# EAGLE board moire_v2.1 (EAGLE 9.2.0)
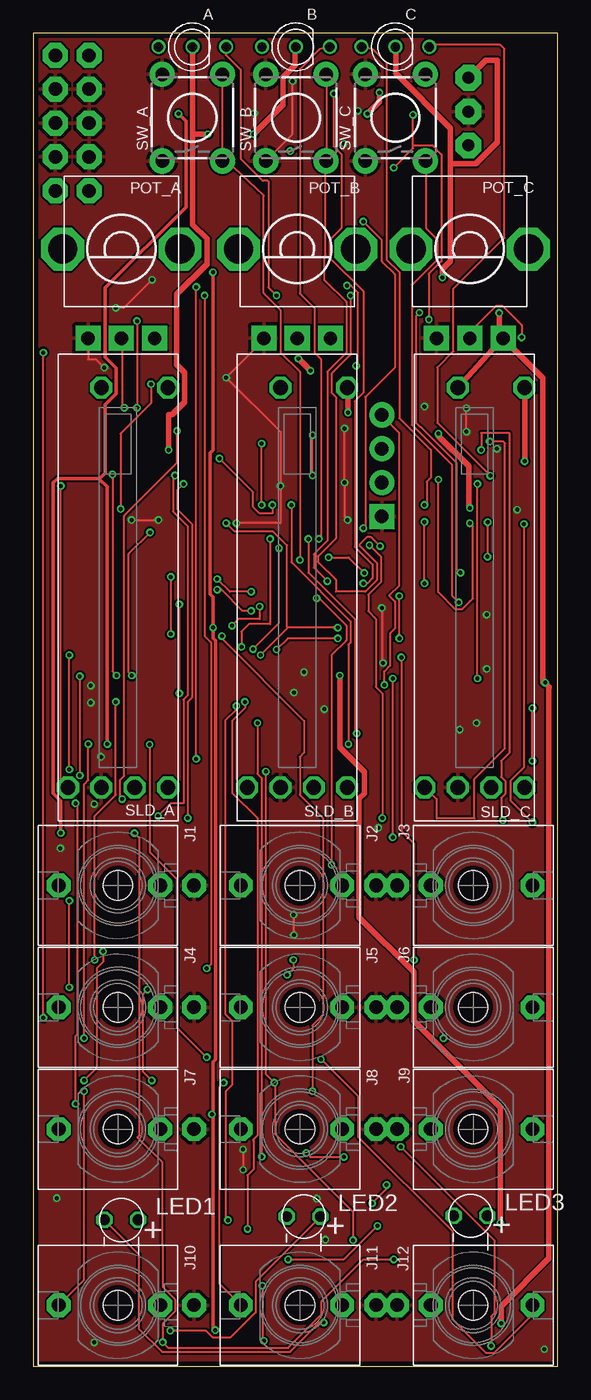
[diagram p3: board, top side]
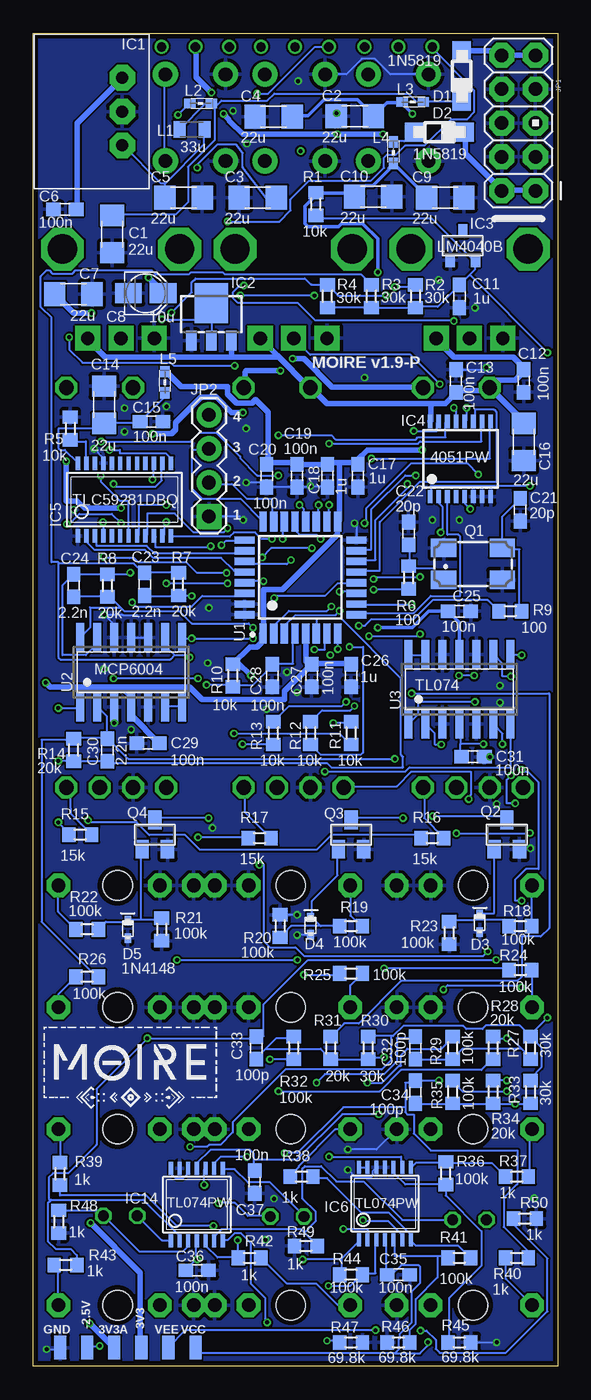
[diagram p4: board, bottom side, seen from below]

Size 39.35 x 100 mm. Coordinates in mm from the lower left corner, seen from the top.
Outline: 0,0 39.35,0 39.35,100 0,100 0,0
Copper layers (1*16): Top 0.035559375mm / dielectric 1.6mm / Bottom 0.035559375mm
Design rules "oshpark-2layer *": minimum track width 6mil, minimum drill 0.3mm, track to track 6mil, track to pad 6mil, pad to pad 6mil, via to via 6mil, smd to smd 0mil, copper to edge 15mil, drill to drill 6mil, minimum pad ring 5mil, minimum via ring 5mil, stop-mask expansion 2.5mil, vias tented up to drill 13mil, thermal gap 10mil
Net classes: 1 power: width 0.406 mm

## Footprints (pad centres in the part's own frame; a part is rotated, then mirrored left to right if it is on the bottom)
LED-BICOLOR-THROUGHHOLE-LUMEX = drill 0.7: A 0,0; GREEN_C 2.54,0; RED_C -2.54,0
RCL_C1206 = smd 1.6 x 1.8: 1 -1.4,0; 2 1.4,0
RCL_C0603 = smd 1.1 x 1: 1 -0.85,0; 2 0.85,0
RCL_PANASONIC_A = smd 2 x 1.5: + 1.3,0; - -1.3,0
DIODE_SOD123 = smd 1.4 x 1.4: A 1.9,0; C -1.9,0
DIODE_SOD523 = smd 0.7 x 0.5: A 0.7,0; C -0.6,0
WE78 = drill 0.9 pad 1.93 octagon: 1 -2.54,0; 2 0,0; 3 2.54,0
SOT89 = smd 0.8 x 1.5: 1 -1.5,-1.75; 2 0,-1.75; 3 1.5,-1.75 | smd 2.5 x 3: 4 0,1.05
DBZ_R-PDSO-G3 = smd 0.7 x 1: 1 -0.95,-1.1; 2 0.95,-1.1; 3 0,1.1
TSSOP16_065 = smd 0.35 x 1: 1 -1.95,-2.825; 2 -1.3,-2.825; 3 -0.65,-2.825; 4 0,-2.825; 5 0.65,-2.825; 6 1.3,-2.825; 7 1.95,-2.825; 8 2.6,-2.825; 9 2.6,2.825; 10 1.95,2.825; 11 1.3,2.825; 12 0.65,2.825; 13 0,2.825; 14 -0.65,2.825; 15 -1.3,2.825; 16 -1.95,2.825
TSSOP24_0635 = smd 0.33 x 1: 1 -3.493,-2.725; 2 -2.857,-2.725; 3 -2.223,-2.725; 4 -1.587,-2.725; 5 -0.953,-2.725; 6 -0.318,-2.725; 7 0.318,-2.725; 8 0.953,-2.725; 9 1.587,-2.725; 10 2.223,-2.725; 11 2.857,-2.725; 12 3.493,-2.725; 13 3.493,2.725; 14 2.857,2.725; 15 2.223,2.725; 16 1.587,2.725; 17 0.953,2.725; 18 0.318,2.725; 19 -0.318,2.725; 20 -0.953,2.725; 21 -1.587,2.725; 22 -2.223,2.725; 23 -2.857,2.725; 24 -3.493,2.725
TSSOP14_065 = smd 0.305 x 0.991: 1 -1.95,-2.718; 2 -1.3,-2.718; 3 -0.65,-2.718; 4 0,-2.718; 5 0.65,-2.718; 6 1.3,-2.718; 7 1.95,-2.718; 8 1.95,2.718; 9 1.3,2.718; 10 0.65,2.718; 11 0,2.718; 12 -0.65,2.718; 13 -1.3,2.718; 14 -1.95,2.718
WQP_PJ_301M6 = drill 1.016 pad 1.778 octagon: P1 0,-5.715; P2 0,-3.175; P3 0,4.445 | hole 2.2: 0,0
2X5-PTH = drill 1.016 pad 1.88 octagon: 1 -1.27,5.08; 2 1.27,5.08; 3 -1.27,2.54; 4 1.27,2.54; 5 -1.27,0; 6 1.27,0; 7 -1.27,-2.54; 8 1.27,-2.54; 9 -1.27,-5.08; 10 1.27,-5.08
1X04 = drill 1.016 pad 1.88 square: 1 0,0 | drill 1.016 pad 1.88: 2 2.54,0; 3 5.08,0; 4 7.62,0
L2012C = smd 0.9 x 1.25: 1 -0.9,0; 2 1,0
0603 = smd 0.85 x 0.7: 1 -0.9,0; 2 0.7,0
LED3MM = drill 0.813 octagon: 1 -1.27,0; 2 1.27,0
ALPS_POT_VERTICAL = drill 1 pad 1.88 square: P$1 -2.5,6.7; P$2 0,6.7; P$3 2.5,6.7 | drill 2.2 pad 3.175 octagon: P$4 -4.4,0; P$5 4.4,0
CTS406 = smd 1.9 x 1.4: 1 -2.2,-1.2; 2 2.2,-1.2; 3 2.2,1.2; 4 -2.2,1.2
SOT23-BEC = smd 1 x 1.4: B -0.95,-1.1; C 0,1.1; E 0.95,-1.1
RCL_R0603 = smd 1 x 1.1: 1 -0.85,0; 2 0.85,0
BOURNS_SLIDER = drill 1.1 octagon: 1 -15,1.25; 2 -15,3.75; 3 15,1.25; B 15,-3.75; DUMMY -15,-1.25; E -15,-3.75
TACTILE-PTH = drill 1.016 pad 1.88: 1 -3.251,2.261; 2 3.251,2.261; 3 -3.251,-2.261; 4 3.251,-2.261
QFP80P900X900X160-32N = smd 1.5 x 0.55: 1 -4.2,2.8; 2 -4.2,2; 3 -4.2,1.2; 4 -4.2,0.4; 5 -4.2,-0.4; 6 -4.2,-1.2; 7 -4.2,-2; 8 -4.2,-2.8; 17 4.2,-2.8; 18 4.2,-2; 19 4.2,-1.2; 20 4.2,-0.4; 21 4.2,0.4; 22 4.2,1.2; 23 4.2,2; 24 4.2,2.8 | smd 0.55 x 1.5: 9 -2.8,-4.2; 10 -2,-4.2; 11 -1.2,-4.2; 12 -0.4,-4.2; 13 0.4,-4.2; 14 1.2,-4.2; 15 2,-4.2; 16 2.8,-4.2; 25 2.8,4.2; 26 2,4.2; 27 1.2,4.2; 28 0.4,4.2; 29 -0.4,4.2; 30 -1.2,4.2; 31 -2,4.2; 32 -2.8,4.2
SO14 = smd 0.6 x 2.2: 1 -3.81,-2.6; 2 -2.54,-2.6; 3 -1.27,-2.6; 4 0,-2.6; 5 1.27,-2.6; 6 2.54,-2.6; 7 3.81,-2.6; 8 3.81,2.6; 9 2.54,2.6; 10 1.27,2.6; 11 0,2.6; 12 -1.27,2.6; 13 -2.54,2.6; 14 -3.81,2.6
6X1-SMD-TESTPAD = smd 0.914 x 1.778: 1 0,0.123; 2 -2.032,0.123; 3 -4.064,0.123; 4 -6.096,0.123; 5 -8.128,0.123; 6 -10.16,0.123

## Placement (x,y rotation side)
A  SSL-LX3059IGW-CA  [LED-BICOLOR-THROUGHHOLE-LUMEX]  11.94,98.98 180 top
B  SSL-LX3059IGW-CA  [LED-BICOLOR-THROUGHHOLE-LUMEX]  19.71,98.98 180 top
C  SSL-LX3059IGW-CA  [LED-BICOLOR-THROUGHHOLE-LUMEX]  27.18,98.98 180 top
C1  22u  [RCL_C1206]  33.43,84.94 270 bottom
C2  22u  [RCL_C1206]  15.21,93.78 180 bottom
C3  22u  [RCL_C1206]  22.5,87.68 180 bottom
C4  22u  [RCL_C1206]  21.31,93.75 180 bottom
C5  22u  [RCL_C1206]  28.07,87.68 0 bottom
C6  100n  [RCL_C0603]  36.98,86.79 180 bottom
C7  22u  [RCL_C1206]  36.35,80.44 0 bottom
C8  10u  [RCL_PANASONIC_A]  30.91,80.49 0 bottom
C9  22u  [RCL_C1206]  8.43,87.68 180 bottom
C10  22u  [RCL_C1206]  13.84,87.73 180 bottom
C11  1u  [RCL_C0603]  7.37,80.26 270 bottom
C12  100n  [RCL_C0603]  2.54,73.91 270 bottom
C13  100n  [RCL_C0603]  7.62,73.91 90 bottom
C14  22u  [RCL_C1206]  34.04,72.14 90 bottom
C15  100n  [RCL_C0603]  30.48,70.87 0 bottom
C16  22u  [RCL_C1206]  2.54,69.34 270 bottom
C17  1u  [RCL_C0603]  14.99,66.8 270 bottom
C18  1u  [RCL_C0603]  17.27,66.8 270 bottom
C19  100n  [RCL_C0603]  19.56,66.8 270 bottom
C20  100n  [RCL_C0603]  21.84,66.8 270 bottom
C21  20p  [RCL_C0603]  2.79,64.26 90 bottom
C22  20p  [RCL_C0603]  11.18,62.48 270 bottom
C23  2.2n  [RCL_C0603]  30.99,58.67 270 bottom
C24  2.2n  [RCL_C0603]  36.32,58.57 270 bottom
C25  100n  [RCL_C0603]  7.37,56.64 180 bottom
C26  1u  [RCL_C0603]  15.49,51.82 270 bottom
C27  100n  [RCL_C0603]  18.46,51.82 270 bottom
C28  100n  [RCL_C0603]  21.42,51.82 270 bottom
C29  100n  [RCL_C0603]  30.73,46.74 180 bottom
C30  2.2n  [RCL_C0603]  33.78,46.23 270 bottom
C31  100n  [RCL_C0603]  6.35,45.72 0 bottom
C32  100p  [RCL_C0603]  10.67,23.88 90 bottom
C33  100p  [RCL_C0603]  22.61,23.88 90 bottom
C34  100p  [RCL_C0603]  10.67,20.57 90 bottom
C35  100n  [RCL_C0603]  11.94,6.86 0 bottom
C36  100n  [RCL_C0603]  27.05,7.19 0 bottom
C37  100n  [RCL_C0603]  22.73,13.82 90 bottom
D1  1N5819  [DIODE_SOD123]  7.19,96.8 90 bottom
D2  1N5819  [DIODE_SOD123]  8.86,92.58 180 bottom
D3  1N4148  [DIODE_SOD523]  5.84,33.27 270 bottom
D4  1N4148  [DIODE_SOD523]  18.54,33.07 270 bottom
D5  1N4148  [DIODE_SOD523]  32.26,32.83 270 bottom
IC1  R-78E3.3-0.5  [WE78]  32.66,94.13 90 bottom
IC2  AP7380  [SOT89]  25.98,78.69 0 bottom
IC3  LM4040B  [DBZ_R-PDSO-G3]  7.11,84.07 0 bottom
IC4  4051PW  [TSSOP16_065]  7.62,68.07 0 bottom
IC5  TLC59281DBQ  [TSSOP24_0635]  32.51,65.02 0 bottom
IC6  TL074PW  [TSSOP14_065]  12.95,12.19 0 bottom
IC14  TL074PW  [TSSOP14_065]  27.08,12.12 0 bottom
J1  PJ301_THONKICONN6  [WQP_PJ_301M6]  6.35,36.07 90 top
J2  PJ301_THONKICONN6  [WQP_PJ_301M6]  20.02,36.07 90 top
J3  PJ301_THONKICONN6  [WQP_PJ_301M6]  33.02,36.07 270 top
J4  PJ301_THONKICONN6  [WQP_PJ_301M6]  6.35,26.92 90 top
J5  PJ301_THONKICONN6  [WQP_PJ_301M6]  20.02,26.92 90 top
J6  PJ301_THONKICONN6  [WQP_PJ_301M6]  33.02,26.92 270 top
J7  PJ301_THONKICONN6  [WQP_PJ_301M6]  6.35,17.78 90 top
J8  PJ301_THONKICONN6  [WQP_PJ_301M6]  20.02,17.78 90 top
J9  PJ301_THONKICONN6  [WQP_PJ_301M6]  33.02,17.78 270 top
J10  PJ301_THONKICONN6  [WQP_PJ_301M6]  6.35,4.57 90 top
J11  PJ301_THONKICONN6  [WQP_PJ_301M6]  20.02,4.57 90 top
J12  PJ301_THONKICONN6  [WQP_PJ_301M6]  33.02,4.57 270 top
JP1  M05X2PTH  [2X5-PTH]  2.92,93.27 180 bottom
JP2  [1X04]  26.16,63.75 90 bottom
L1  33u  [L2012C]  27.48,92.79 0 bottom
L2  [0603]  26.7,94.74 0 bottom
L3  [0603]  10.77,94.84 0 bottom
L4  [0603]  12.31,91.14 90 bottom
L5  [0603]  29.46,73.91 90 bottom
LED1  WP937EGW  [LED3MM]  6.6,10.97 0 top
LED2  WP937EGW  [LED3MM]  20.29,11.23 0 top
LED3  WP937EGW  [LED3MM]  32.82,11.28 0 top
POT_A  10kB  [ALPS_POT_VERTICAL]  6.6,83.82 180 top
POT_B  10kB  [ALPS_POT_VERTICAL]  19.81,83.82 180 top
POT_C  10kB  [ALPS_POT_VERTICAL]  32.77,83.82 180 top
Q1  8MHz  [CTS406]  6.35,60.2 0 bottom
Q2  MMBT3904  [SOT23-BEC]  3.81,39.88 0 bottom
Q3  MMBT3904  [SOT23-BEC]  15.49,39.88 0 bottom
Q4  MMBT3904  [SOT23-BEC]  30.23,39.88 0 bottom
R1  10k  [RCL_R0603]  18.14,87.2 270 bottom
R2  30k  [RCL_R0603]  10.67,80.26 270 bottom
R3  30k  [RCL_R0603]  13.97,80.26 270 bottom
R4  30k  [RCL_R0603]  17.27,80.26 270 bottom
R5  10k  [RCL_R0603]  36.58,70.36 90 bottom
R6  100  [RCL_R0603]  11.18,59.18 90 bottom
R7  20k  [RCL_R0603]  28.45,58.67 90 bottom
R8  20k  [RCL_R0603]  33.78,58.57 90 bottom
R9  100  [RCL_R0603]  3.56,56.64 0 bottom
R10  10k  [RCL_R0603]  24.38,51.82 270 bottom
R11  10k  [RCL_R0603]  15.49,47.5 270 bottom
R12  10k  [RCL_R0603]  18.54,47.5 270 bottom
R13  10k  [RCL_R0603]  21.34,47.5 270 bottom
R14  20k  [RCL_R0603]  36.32,46.23 90 bottom
R15  15k  [RCL_R0603]  35.81,39.88 180 bottom
R16  15k  [RCL_R0603]  9.4,39.62 180 bottom
R17  15k  [RCL_R0603]  22.35,39.62 180 bottom
R18  100k  [RCL_R0603]  2.79,33.02 180 bottom
R19  100k  [RCL_R0603]  15.49,33.02 180 bottom
R20  100k  [RCL_R0603]  20.83,33.02 270 bottom
R21  100k  [RCL_R0603]  29.72,32.77 90 bottom
R22  100k  [RCL_R0603]  35.31,32.77 0 bottom
R23  100k  [RCL_R0603]  8.13,32.51 90 bottom
R24  100k  [RCL_R0603]  2.79,29.72 0 bottom
R25  100k  [RCL_R0603]  15.49,29.46 0 bottom
R26  100k  [RCL_R0603]  35.31,29.21 180 bottom
R27  30k  [RCL_R0603]  2.03,23.88 90 bottom
R28  20k  [RCL_R0603]  4.83,23.88 270 bottom
R29  100k  [RCL_R0603]  7.87,23.88 270 bottom
R30  30k  [RCL_R0603]  14.22,23.88 90 bottom
R31  20k  [RCL_R0603]  17.02,23.88 90 bottom
R32  100k  [RCL_R0603]  19.81,23.88 90 bottom
R33  30k  [RCL_R0603]  2.03,20.57 90 bottom
R34  20k  [RCL_R0603]  4.83,20.57 90 bottom
R35  100k  [RCL_R0603]  7.87,20.57 270 bottom
R36  100k  [RCL_R0603]  8.38,14.48 270 bottom
R37  1k  [RCL_R0603]  3.05,14.22 180 bottom
R38  1k  [RCL_R0603]  19.2,14.22 0 bottom
R39  1k  [RCL_R0603]  37.34,14.43 270 bottom
R40  1k  [RCL_R0603]  3.05,8.13 0 bottom
R41  100k  [RCL_R0603]  7.37,8.13 180 bottom
R42  1k  [RCL_R0603]  23.11,8.13 180 bottom
R43  1k  [RCL_R0603]  36.93,7.59 0 bottom
R44  100k  [RCL_R0603]  15.49,6.86 0 bottom
R45  69.8k  [RCL_R0603]  7.37,1.78 0 bottom
R46  69.8k  [RCL_R0603]  11.94,1.78 180 bottom
R47  69.8k  [RCL_R0603]  15.49,1.78 0 bottom
R48  1k  [RCL_R0603]  37.44,10.85 270 bottom
R49  1k  [RCL_R0603]  18.9,9.02 180 bottom
R50  1k  [RCL_R0603]  2.44,11.07 0 bottom
SLD_A  20kB  [BOURNS_SLIDER]  6.35,58.42 90 top
SLD_B  20kB  [BOURNS_SLIDER]  19.81,58.42 90 top
SLD_C  20kB  [BOURNS_SLIDER]  33.12,58.42 90 top
SW_A  [TACTILE-PTH]  11.94,93.68 90 top
SW_B  [TACTILE-PTH]  19.71,93.68 90 top
SW_C  [TACTILE-PTH]  27.18,93.68 90 top
U1  STM32F303K8T6  [QFP80P900X900X160-32N]  19.3,59.18 90 bottom
U2  MCP6004  [SO14]  32,52.07 0 bottom
U3  TL074  [SO14]  7.37,50.8 0 bottom
U$1  1X6-SMD-TESTPAD  [6X1-SMD-TESTPAD]  27.18,1.27 0 bottom

## Tracks (layer width: path | path; a pad name or v marks a point on that pad's centre or on a via)
+3V3  (via drill 0.3)
  Top 0.406: v10.16,68.74 10.16,71.4 10.41,71.4 11.35,72.34 11.35,74.55 10.77,75.13 10.77,80.42 13.03,82.68 13.03,84.58 11.96,85.65 11.96,92.43 | C.A 27.2,98.98 27.2,97 31.32,92.89 31.32,90.22 | 11.96,92.43 11.96,98.98 A.A | v16.54,92.43 18.75,94.64 18.75,96.7 19.66,97.61 19.66,98.98 B.A | 11.96,92.43 v13.11,92.43 | v30.71,81.69 30.71,82.3 31.32,82.91 31.32,90.22 | 31.32,90.22 33.22,90.22 34.82,91.82 34.82,97.99 33.98,97.99 IC1.3 | v25.98,95.56 25.98,94.87 v25.07,93.95 | v35.05,10.74 35.05,19.43 28.57,25.91 28.57,29.57 24.46,33.68 24.46,42.6 24.84,42.98 24.84,44.58 23.01,46.41 v23.01,51.82
  Bottom 0.406: L5.2 29.37,74.61 28.26,73.5 24.77,73.5 24.77,72.92 24.08,72.24 22.94,72.24 22.66,72.51 21.75,71.6 21.75,67.94 C20.1 21.75,67.79 19.68,67.79 C19.1 19.37,67.63 17.46,67.63 C18.1 17.14,67.79 16.35,67.79 | 16.35,67.79 15.08,67.79 C17.1 15.08,67.94 14.29,68.74 v10.16,68.74 | 16.35,67.79 16.35,63.5 U1.17 16.51,63.18 16.51,62.39 20.64,58.26 22.07,58.26 22.07,55.09 U1.1 22.23,54.93 22.23,54.29 22.54,53.98 23.07,53.98 R10.1 24,52.81 v23.01,51.82 | v13.11,92.43 v16.54,92.43 23.62,92.43 24.61,93.42 24.69,93.57 v25.07,93.95 | C8.+ 29.56,80.54 v30.71,81.69 | C6.1 36.04,86.86 36.04,93.27 32.69,96.62 IC1.3 | v25.98,95.56 27.13,96.7 27.13,98.98 C.A | v35.05,10.74 31.32,7.01 31.32,1.6 U$1.3
+3V3_A  (via drill 0.3)
  Top 0.406: SLD_C.3 POT_C.P$1 | POT_C.P$1 35.4,76.99 38.26,74.14 38.26,51.28 v38.42,51.28 38.73,50.96 38.71,50.83 38.71,8.08 35.12,4.48 v35.12,3.21 | v34.98,79.02 34.98,77.57 35.2,77.34 POT_C.P$1
  Bottom 0.406: 9.53,72.23 9.53,70.96 IC4.16 | 9.53,72.23 8.41,72.23 7.62,73.03 C13.1 7.46,73.18 5.08,73.18 SLD_A.3 | SLD_A.3 5.08,73.5 4.6,73.98 3.17,73.98 2.54,74.61 C12.1 2.54,74.93 3.33,75.72 7.78,75.72 9.05,76.99 POT_A.P$1 | 9.53,72.23 17.3,72.23 18.41,73.34 SLD_B.3 18.73,73.5 21.03,75.8 | 21.03,75.8 22.23,76.99 POT_B.P$1 | 24.49,75.72 21.11,75.72 21.03,75.8 | 24.49,75.72 33.97,75.72 35.24,76.99 POT_C.P$1 | C26.1 15.56,52.7 18.41,52.7 C27.1 | U1.5 18.89,54.93 18.89,52.86 18.41,52.86 C27.1 | C29.1 30,46.83 31.91,48.74 31.91,49.37 U2.4 32.07,49.53 32.07,50.32 32.7,50.96 | v35.12,3.21 33.34,1.43 U$1.4 | v38.42,51.28 38.1,50.96 32.7,50.96 | 32.7,50.96 27.62,50.96 26.67,50.01 20.48,50.01 20.48,50.64 18.57,52.55 C27.1 | SLD_A.3 2.54,70.86 C16.1 | 24.49,75.72 24.48,75.72 IC2.3 | v34.98,79.02 36.33,79.02 C7.1
+12V
  Bottom 0.406: D1.A 7.16,98.68 4.5,98.68 4.19,98.37 JP1.10 4.04,98.37 1.68,98.37 JP1.9
-12V
  Bottom 0.406: D2.C 6.93,92.58 6.93,90.98 4.19,88.24 JP1.2 4.04,88.24 1.68,88.24 JP1.1
A_ADC  (via drill 0.3)
  Top 0.152: v10.95,57.15 v10.95,50.48
  Bottom 0.152: v10.95,50.48 0.64,50.48 0.64,32.86 1.27,32.23 2.7,32.23 2.7,29.21 3.02,28.89 11.75,28.89 14.92,25.72 16.03,25.72 16.05,25.7 16.05,25.69 R31.2 | v10.95,57.15 15.08,57.15 U1.10
A_CV  (via drill 0.3)
  Top 0.152: v37.47,45.4 v37.47,49.37
  Bottom 0.152: U1.6 18.1,55.09 18.1,56.04 16.19,56.04 11.75,51.59 11.75,45.88 11.59,45.72 11.59,44.93 16.99,44.93 17.3,45.24 33.66,45.24 C30.2 33.81,45.4 36.2,45.4 R14.1 36.35,45.4 v37.47,45.4 | v37.47,49.37 35.88,49.37 U2.1
A_GATE  (via drill 0.3)
  Top 0.152: v23.65,46.67 23.65,54.13 23.81,54.29 23.81,55.88 19.37,60.33 v19.37,64.61
  Bottom 0.152: v19.37,64.61 19.05,64.29 19.05,63.5 U1.20 | v23.65,46.67 21.36,46.67 R13.2
A_TRIG  (via drill 0.3)
  Top 0.152: v26.19,41.12 26.19,50.48 25.72,50.96 25.72,56.07 25.15,56.64 25.15,57.89 26.1,58.85 26.1,60.73 v25.23,61.59
  Bottom 0.152: v26.19,41.12 30.16,41.12 Q4.C | v25.23,61.59 24.92,61.91 23.65,61.91 U1.25
A_TRIG_IN
  Bottom 0.152: R22.1 37.47,34.08 J3.P3
ADC_TIME_SHAPE
  Bottom 0.152: IC4.3 8.26,65.25 8.26,62.39 7.46,62.39 7.3,62.23 7.3,57.78 9.53,57.78 10.79,56.52 15.08,56.52 U1.9
AREF_-2.5  (via drill 0.3)
  Top 0.152: v34.37,1.52 34.37,3.73 34.59,3.96 34.59,9.45 v27.58,16.46 | v0.76,26.14 v0.76,76.05
  Bottom 0.152: R4.2 17.22,79.4 14.02,79.4 R3.2 13.95,79.4 R2.2 10.67,79.48 8.99,79.48 7.39,81.08 C11.1 7.32,81.15 6.59,81.88 | 6.59,81.88 6.17,82.3 6.17,82.91 IC3.2 6.25,82.91 9.42,86.08 18.14,86.08 R1.2 | R33.2 1.98,21.49 1.98,21.64 1.22,22.4 1.22,23.93 1.98,24.69 R27.2 | 12.5,24.77 12.34,24.77 11.58,25.53 7.09,25.53 6.86,25.3 5.64,25.3 5.38,25.55 2.85,25.55 2.06,24.77 R27.2 | 12.5,24.77 14.17,24.77 R30.2 | v34.37,1.52 34.44,1.45 35.28,1.45 U$1.5 | v27.58,16.46 26.29,16.46 26.14,16.61 25.3,16.61 24.38,17.53 24.38,18.29 20.42,22.25 13.18,22.25 12.5,22.94 12.5,24.77 | v0.76,76.05 6.55,81.84 6.59,81.88 | v0.76,26.14 2.06,24.84 R27.2
B_ADC  (via drill 0.3)
  Top 0.152: v20.95,20.64 20.95,25.56 21.75,26.35 21.75,41.12 20,42.86 20,45.72 20.32,46.04 20.32,48.42 14.15,54.59 v14.15,54.77 | v10.32,59.21 v10.32,54.93 | v13.81,59.05 14.76,58.1 v16.35,58.1
  Bottom 0.152: v20.95,20.64 13.34,20.64 11.75,22.23 5.71,22.23 4.91,23.03 R28.2 | v14.15,54.77 10.48,54.77 v10.32,54.93 | v10.32,59.21 13.65,59.21 v13.81,59.05 | v16.35,58.1 15.24,58.1 U1.11
B_CV  (via drill 0.3)
  Top 0.152: v18.26,53.77 19.1,54.61 v22.86,54.61 | v27.46,54.61 v27.46,57.78
  Bottom 0.152: v18.26,53.77 17.46,53.77 17.46,54.93 U1.7 | v22.86,54.61 v27.46,54.61 28.1,54.61 U2.8 | v27.46,57.78 28.42,57.78 R7.1 28.57,57.78 30.95,57.78 C23.2
B_CV_IN
  Bottom 0.152: R25.2 14.76,29.37 15.56,28.57 15.56,26.94 J5.P3
B_GATE  (via drill 0.3)
  Top 0.152: v17.78,62.07 17.78,55.68 16.18,55.68 15.62,55.12 v15.62,53.96
  Bottom 0.152: v15.62,53.96 14.61,53.96 14.61,46.04 14.76,45.88 17.78,45.88 17.78,45.89 R12.2 | v17.78,62.07 18.1,62.39 19.37,62.39 19.68,62.71 19.68,63.34 U1.21
B_TRIG  (via drill 0.3)
  Top 0.152: v11.59,41.12 11.59,49.85 11.91,50.16 11.91,63.18 10.79,64.29 10.79,65.72 v11.27,66.2
  Bottom 0.152: v11.59,41.12 15.4,41.12 Q3.C | v11.27,66.2 11.27,65.88 13.65,63.5 13.65,60.48 15.08,60.48 U1.14
B_TRIG_IN
  Bottom 0.152: J2.P3 15.56,36.06 15.56,33.81 14.76,33.02 R19.1
C_ADC  (via drill 0.3)
  Top 0.152: v3.81,21.43 4.76,22.38 4.76,29.84 5.24,30.32 v5.24,31.11 | v22.38,37.62 22.38,53.34 23.5,54.45 23.5,55.56 21.43,57.63 v21.27,57.63
  Bottom 0.152: v3.81,21.43 4.76,21.43 R34.2 | v5.24,31.11 5.56,30.8 19.05,30.8 19.68,31.43 21.59,31.43 22.07,31.91 22.07,37.62 v22.38,37.62 | v21.27,57.63 21.11,57.78 17.46,57.78 16.51,58.74 15.24,58.74 U1.12
C_CV  (via drill 0.3)
  Top 0.152: 19.1,55.4 v17.06,53.36 | v22.86,55.4 19.1,55.4 | v8.76,62.56 7.16,60.96 7.16,52.05 v7.39,51.82 | v6.25,51.82 5.94,52.12 v5.94,66.9 | v14.48,63.25 15.09,62.64 17.98,62.64 19.05,61.57 19.05,55.47 19.05,55.4 19.1,55.4
  Bottom 0.152: v22.86,55.4 23.18,55.72 27.46,55.72 28.42,56.67 32.54,56.67 32.8,56.93 | 32.8,56.93 33.51,57.64 R8.1 33.84,57.78 36.26,57.78 C24.2 | 32.8,56.93 35.08,56.93 35.08,55.4 35.72,54.77 U2.14 | v8.76,62.56 8.61,62.71 8.61,64.47 8.91,64.77 8.91,65.23 IC4.2 | v6.25,51.82 v7.39,51.82 | v5.94,66.9 6.78,67.74 10.97,67.74 14.33,64.39 14.33,63.4 v14.48,63.25
C_GATE  (via drill 0.3)
  Top 0.152: v24.29,47.47 24.13,47.62 24.13,56.04 20.64,59.53 v20.64,62.07
  Bottom 0.152: v24.29,47.47 16.35,47.47 15.56,46.67 R11.2 | v20.64,62.07 20.64,63.34 U1.22
C_TRIG  (via drill 0.3)
  Top 0.152: v9.37,41.27 10.32,42.23 11.27,42.23 11.27,50.01 11.59,50.32 11.59,63.02 10.48,64.14 10.48,66.67 v10.64,66.83
  Bottom 0.152: v9.37,41.27 3.97,41.27 3.81,41.12 Q2.C | v10.64,66.83 11.43,66.83 13.97,64.29 13.97,61.28 15.08,61.28 U1.15
C_TRIG_IN
  Bottom 0.152: R18.1 1.94,36.03 J1.P3
GND  (via drill 0.3)
  Top 0.152: v15.75,16.26 v15.75,14.73 | v7.37,63.5 v9.4,63.5 | v5.33,74.93 4.73,75.53 4.1,75.53 POT_A.P$3 | POT_B.P$3 17.31,77 v14.48,74.17 18.54,70.1 v18.54,66.04 18.54,63.25 v15.24,63.25 | v23.6,63.5 23.37,63.73 v23.37,66.29 v23.37,70.36 | v32.51,70.1 v32.51,71.88 | v19.55,32.35 v19.55,33.86 v19.54,33.87 | SW_B.1 19.47,92.45 v19.47,96.42 | v8.91,81.51 6.81,79.4 v6.2,79.4 | v26.16,56.9 26.16,52.86 v26.26,52.76 | J9.P1 26.75,17.68 26.75,17.7
  Bottom 0.152: v38.35,1.27 37.46,1.27 U$1.6 | R45.2 v4.57,1.78 | J7.P1 13.59,16.26 v15.75,16.26 | v15.75,14.73 15.7,14.73 15.15,14.19 14.01,14.19 13.87,14.32 13.87,14.64 IC6.12 | v15.24,63.25 15.1,63.11 U1.16 | v23.37,66.29 22.19,66.29 C20.2 C19.2 18.63,65.95 v18.54,66.04 17.36,66.04 C18.2 | v23.6,63.5 23.85,63.75 JP2.1 | U2.12 33.27,55.63 v34.04,56.39 32.69,56.39 32.67,56.37 31.58,56.37 31.42,56.21 | U2.11 U2.10 | C13.2 5.5,74.76 v5.33,74.93 | v34.8,68.83 34.1,68.14 IC5.21 | D4.A 18.56,32.35 v19.55,32.35 | v19.54,33.87 R20.1 | SW_A.2 12.55,96.93 13.71,98.09 14.68,98.09 15.85,96.93 SW_B.2 | v26.26,52.76 26.29,52.73 | 30.86,49.45 U2.5 | POT_B.P$3 17.53,77.12 | R50.2 1.6,11.12 1.67,11.12 | IC2.1 27.46,76.94
  Bottom 0.254: v33.27,48.26 U2.3
  other vias: 36.32,64.26 4.32,49.78 4.32,51.05 5.08,45.72 4.57,42.16 2.03,38.86 20.32,52.07 19.56,50.55 34.04,52.32 21.84,49.3 32,47.75 25.91,40.39 16.59,94.01 24.36,94.18 23.32,91.72 1.75,12.6 21.29,12.57 21.92,9.5 29.36,72.01
  pour Bottom: 39.88,100.74 -0.76,100.74 -0.76,-0.25 0,-1.02 39.88,-1.02
  pour Top: 0,-1.78 39.37,-1.78 40.39,-0.76 40.39,101.93 -2.03,101.93 -2.03,0.25
LEDS_SCK
  Bottom 0.152: IC5.3 34.61,62.23 34.61,61.54 30.84,61.54 30.25,60.96 23.81,60.96 23.65,61.12 U1.26
LEDS_SIN
  Bottom 0.152: U1.28 23.65,59.69 24.29,59.69 25.24,60.64 30.36,60.64 30.96,61.24 34.73,61.24 35.37,61.88 IC5.2
LEDS_SS  (via drill 0.3)
  Top 0.152: v16.49,53.79 18.44,55.74 18.44,57.23 | 18.44,57.23 | 18.44,57.23 v18.44,61.37 | v22.17,60.69 23.67,60.69 v24.84,59.51 | v34.09,60.73 34.11,60.76 v34.11,63.32
  Bottom 0.152: U1.8 16.5,53.81 v16.49,53.79 | v18.44,61.37 21.49,61.37 v22.17,60.69 | 32.13,60.63 31.78,60.63 31.45,60.3 27.85,60.3 27.06,59.51 v24.84,59.51 | 32.13,60.63 | v34.09,60.73 33.98,60.63 32.13,60.63 | v34.11,63.32 34.11,62.31 IC5.4
N$1
  Bottom 0.152: R15.1 35.77,40.68 35.77,40.69 36.51,41.43 36.59,43.19 SLD_C.E
N$2
  Bottom 0.152: R39.1 37.34,15.32 37.34,17.68 37.41,17.75 J9.P3
N$3
  Bottom 0.152: L4.2 12.27,91.9 11.51,91.9 10.82,92.58 D2.A
N$4
  Bottom 0.152: D1.C 7.24,94.87 10.06,94.87 L3.2 10.13,94.87 10.59,94.87 11.2,95.48 21.26,95.48 21.79,94.94 25.22,94.94 25.76,94.41 L2.2 | L2.2 26.06,94.72 26.44,94.72 28.35,92.81 L1.1 | C1.1 33.38,86.41 28.65,86.41 27.74,87.33 27.74,89.99 25.76,91.97 25.76,94.34 26.06,94.64 L2.2
N$5  (via drill 0.3)
  Top 0.152: 28.5,91.59 28.5,91.36 v27.05,89.92 | 28.5,91.59 v28.5,93.88 | v29.69,78.54 29.69,81.97 30.63,82.91 30.63,90.91 29.95,91.59 28.5,91.59
  Bottom 0.152: v28.5,93.88 27.66,94.72 L2.1 | C3.1 21.11,87.71 21.11,87.78 21.18,87.78 C3.1 | C3.1 21.86,87.68 23.64,89.96 23.64,91.03 24.14,91.68 25.52,91.68 27.05,90.14 v27.05,89.92 | v29.69,78.54 27.19,78.54 IC2.4 IC2.2
N$6
  Bottom 0.152: IC6.13 14.29,14.92 14.76,14.92 IC6.14
N$7  (via drill 0.3)
  Top 0.152: v14.29,21.27 13.97,20.95 13.97,6.19 15.55,4.61 J11.P3
  Bottom 0.152: R42.1 22.23,8.1 20.32,6.19 18.1,6.19 16.51,4.6 15.66,4.6 J11.P3 | v14.29,21.27 13.18,21.27 11.91,22.54 11.75,22.54 11.75,23.34 11.27,23.81 8.73,23.81 7.87,24.67 R29.1
N$8  (via drill 0.3)
  Top 0.152: v4.13,46.67 4.13,43.97 3.81,43.66 v3.81,24.61
  Bottom 0.152: C32.1 10.64,23.02 7.94,23.02 R29.2 7.78,23.18 7.14,23.81 2.7,23.81 | 2.7,23.81 3.49,24.61 v3.81,24.61 4.76,24.61 R28.1 | 2.7,23.81 2.03,23.15 R27.1 | v4.13,46.67 4.13,47.47 4.76,48.1 U3.6
N$9  (via drill 0.3)
  Top 0.152: v14.92,55.56 15.4,56.04 16.99,56.04 v16.99,56.99
  Bottom 0.152: v14.92,55.56 14.45,55.56 13.97,56.04 10.79,56.04 9.37,57.47 5.23,57.47 R9.1 | v16.99,56.99 17.3,56.67 20.16,56.67 21.27,55.56 21.27,55.09 U1.2
N$10  (via drill 0.3)
  Top 0.152: v13.81,58.26 14.13,58.26 15.72,56.67 v16.35,56.67
  Bottom 0.152: v16.35,56.67 16.67,56.36 19.68,56.36 20.48,55.56 20.48,55.09 U1.3 | R6.1 11.25,58.26 v13.81,58.26
N$11
  Bottom 0.152: R9.2 2.86,56.79 2.86,61.28 4.13,61.28 Q1.3 4.13,61.44 4.13,63.75 2.79,65.09 C21.2
N$12
  Bottom 0.152: Q1.1 8.57,59.05 9.37,59.85 10.95,59.85 11.11,60.01 R6.2 11.11,60.17 11.11,61.57 C22.2
N$13
  Bottom 0.152: J8.P3 15.57,17.75 16.69,17.75 19.43,15.01 19.43,14.94 20.04,14.33 20.04,14.25 R38.1
N$14
  Bottom 0.152: U3.13 10,53.34 11.11,53.34 U3.14
N$15  (via drill 0.3)
  Top 0.152: v17.46,44.61 17.46,21.91 v18.1,21.27 18.14,21.26 18.14,17.45 24,11.58 v24,9.45
  Bottom 0.152: v18.1,21.27 17.46,21.91 13.02,21.91 12.06,22.86 12.06,24.61 10.79,24.61 C32.2 | v17.46,44.61 11.43,44.61 11.11,44.93 3.49,44.93 3.49,48.1 U3.7 | IC14.5 26.36,9.37 26.36,8.99 25.53,8.15 24,8.15 R42.2 24,8.23 v24,9.45
N$16  (via drill 0.3)
  Top 0.152: v25.83,10.52 23.32,8 v19.13,8
  Bottom 0.152: 16.19,8 16.19,6.99 R44.1 | 16.19,8 16.19,8.1 14.92,9.37 IC6.1 | v19.13,8 16.23,8 16.19,8 | R39.2 37.34,12.8 30.89,12.8 28.6,10.52 v25.83,10.52
N$17  (via drill 0.3)
  Top 0.152: J10.P3 3.81,6.48 3.81,20.57 v3.81,20.64
  Bottom 0.152: v3.81,20.64 7.14,20.64 7.87,21.37 R35.1 | J10.P3 3.89,6.55 3.89,8.08 R40.1
N$18  (via drill 0.3)
  Top 0.152: v3.49,51.75 v3.49,44.32 | v3.17,42.23 3.33,42.07 3.33,24.92 3.17,24.77 v3.17,19.68
  Bottom 0.152: R33.1 2.06,19.68 v3.17,19.68 4.76,19.68 R34.1 4.92,19.68 7.78,19.68 R35.2 7.94,19.68 10.64,19.68 C34.1 | v3.49,51.75 4.13,51.75 4.13,52.7 4.76,53.34 U3.9 | v3.49,44.32 3.81,44 3.81,42.23 v3.17,42.23
N$19  (via drill 0.3)
  Top 0.152: v2.7,44.77 v2.7,53.34 | v2.7,28.42 v2.7,34.92 | v8.57,28.26 8.26,27.94 8.26,22.07 v8.89,21.43 | v23.32,15.7 20.8,15.7 v20.5,16
  Bottom 0.152: 11.43,19.43 11.43,21.27 10.79,21.27 C34.2 10.64,21.43 v8.89,21.43 | 11.43,19.43 11.43,19.05 11.27,18.89 10.79,18.89 10.79,17.46 9.53,16.19 3.02,16.19 3.02,13.65 3.05,13.64 4.04,12.65 4.04,10.44 2.21,8.61 2.21,8.15 R40.2 | v2.7,53.34 3.49,53.34 U3.8 | v2.7,44.77 2.54,44.61 2.22,44.61 1.43,43.81 1.43,37.31 2.38,37.31 3.17,36.51 3.17,34.92 v2.7,34.92 | v2.7,28.42 2.86,28.57 8.26,28.57 v8.57,28.26 | v23.32,15.7 25.3,15.7 25.76,15.24 25.76,14.86 IC14.9 | v20.5,16 19.51,16 16.08,19.43 11.43,19.43
N$20
  Bottom 0.152: J7.P3 2.06,17.78 2.06,14.36 R37.1
N$21
  Bottom 0.152: J4.P3 1.91,29.69 R24.2
N$22
  Bottom 0.152: R26.2 37.47,27.9 J6.P3
N$23  (via drill 0.3)
  other vias: 19.28,91.16
N$24  (via drill 0.3)
  Top 0.152: v17.3,1.91 17.2,2.01 v17.2,6.03
  Bottom 0.152: IC6.3 13.65,9.37 13.65,6.99 14.61,6.99 R44.2 14.76,6.83 15.56,6.03 v17.2,6.03 | R47.1 16.47,1.91 v17.3,1.91
N$25  (via drill 0.3)
  Top 0.152: v15.88,49.85 15.88,49.37 14.92,48.42 14.92,43.02 16.83,41.12 16.83,17.3 16.51,16.99 16.54,16.92 16.54,14.78 16.08,14.33 16.08,10.36 v16.08,10.29
  Bottom 0.152: v16.08,10.29 14.29,10.29 14.29,9.53 IC6.2 | v15.88,49.85 16.19,49.53 20.16,49.53 21.27,48.42 R13.1
N$26
  Bottom 0.152: R41.1 6.67,8.26 7.46,9.05 10.64,9.05 10.95,9.37 IC6.7 11.05,9.53 11.05,9.91 12.65,11.51 14.71,11.51 17.3,14.1 18.21,14.1 R38.2
N$27  (via drill 0.3)
  Top 0.406: v19.89,75.59 v20.8,74.68 | v36.88,67.89 36.88,73.46 SLD_C.B | v30.4,69.95 30.4,69.8 32.69,67.51 32.69,64.47 v32.77,64.39 | v23.62,71.55 23.62,73.38 SLD_B.B
  Bottom 0.406: v19.89,75.59 19.05,75.59 16.92,73.46 10.13,73.46 SLD_A.B | v20.8,74.68 23.39,74.68 23.47,74.52 23.47,73.53 23.55,73.46 SLD_B.B | v23.62,71.55 24.46,71.55 25.6,72.69 26.75,72.69 28.65,70.79 28.65,70.26 28.96,69.95 v30.4,69.95 | v32.77,64.39 35.51,64.39 36.04,64.92 36.88,64.92 36.88,65.08 v36.88,67.89
N$28
  Bottom 0.152: IC6.5 12.22,9.37 12.22,8.26 10.16,8.26 9.02,8.26 | R41.2 8.34,8.26 9.02,8.26 | 9.02,8.26 9.02,6.66 10.64,5.04 10.64,3.17 11.09,2.73 R46.1
N$29  (via drill 0.3)
  Top 0.152: v14.61,10.95 14.45,11.11 14.45,20.64 14.92,21.11 14.92,25.91 14.4,26.43 14.4,48.44 15.24,49.28 v15.24,49.53
  Bottom 0.152: v15.24,49.53 15.56,49.21 17.68,49.21 R12.1 | IC6.6 11.73,9.6 11.73,9.91 12.72,10.9 14.55,10.9 v14.61,10.95
N$30
  Bottom 0.152: IC6.8 10.95,14.92 10.64,15.24 8.41,15.24 R36.1 8.26,15.24 4.92,15.24 3.97,14.29 R37.2
N$31
  Bottom 0.152: IC14.12 27.74,14.78 27.74,14.48 28.12,14.1 28.65,14.1 28.96,14.4 28.96,14.78 IC14.14
N$32  (via drill 0.3)
  Top 0.152: v29.37,58.74 v29.37,63.34 | v22.55,95.48 22.55,91.52 23.16,90.91 23.16,85.42 22.25,84.51 22.25,83.21 22.23,83.19 24.77,80.64 24.77,73.03 24.13,72.39 24.13,61.47 25.07,60.53 25.1,60.53 25.46,60.16 25.46,59.13 25.07,58.74 v24.77,58.74
  Bottom 0.152: v29.37,63.34 29.53,63.34 29.53,62.39 IC5.11 | v24.77,58.74 v29.37,58.74 | v22.55,95.48 21.72,95.48 18.21,98.98 17.22,98.98 B.GREEN_C
N$33  (via drill 0.3)
  Top 0.152: v26.03,61.52 25.32,62.23 25.08,62.23 24.49,61.63 24.49,61.57 25.79,60.26 25.79,58.97 24.92,58.1 22.7,58.1 22.7,59 21.36,60.34 21.36,60.76 22.7,62.1 22.7,72.71 22.38,73.03 22.38,74.45 23.81,75.88 v23.81,80.33 | v18.26,80.33 17.63,80.95 17.68,81 17.68,88.85 17.62,88.9 17.6,88.92 17.22,88.92 15.57,90.58 15.57,97.28 14.48,98.37 A.RED_C
  Bottom 0.152: v26.03,61.52 26.11,61.44 30.16,61.44 30.16,62.23 IC5.10 | v18.26,80.33 v23.81,80.33
N$34  (via drill 0.3)
  Top 0.152: v21.43,62.07 21.59,62.23 21.59,75.56 21.11,76.04 21.11,79.38 20,80.49 20,97.31 21.48,98.79 B.RED_C
  Bottom 0.152: v21.43,62.07 22.23,62.07 22.7,62.55 24.29,62.55 24.61,62.23 28.89,62.23 IC5.12
N$35  (via drill 0.3)
  Top 0.152: v34.29,66.81 30.32,70.78 30.32,74.93 31.55,76.16 31.55,80.85 35.36,84.66 35.36,98.83 35.05,99.14 29.87,99.14 C.RED_C
  Bottom 0.152: v34.29,66.81 34.29,66.36 32.86,64.93 32.23,64.93 32.23,62.39 IC5.7
N$36  (via drill 0.3)
  Top 0.152: v29.37,64.61 29.53,64.77 29.53,66.36 29.84,66.67 29.84,68.74 27.46,71.12 27.46,82.07 26.51,83.03 26.51,97.79 25.54,98.76 C.GREEN_C
  Bottom 0.152: v29.37,64.61 31.43,64.61 31.43,62.39 IC5.8
N$40
  Bottom 0.152: 19.01,10.02 18.06,9.07 R49.1 | 19.01,10.02 19.28,10.29 25.22,10.29 25.76,9.75 25.76,9.45 IC14.6 | LED1.2 7.92,10.97 11.66,10.97 14.55,13.87 16.61,13.87 17.75,15.01 18.97,15.01 19.13,14.86 19.13,12.57 18.14,11.58 18.14,10.9 18.97,10.06 19.01,10.02
N$41
  Bottom 0.152: 6.19,33.5 5.87,33.81 D3.C 5.71,33.97 4.76,33.97 4.76,38.73 Q2.B | 7.99,33.5 8.1,33.5 R23.2 7.99,33.5 | 7.99,33.5 6.19,33.5 | R18.2 4.12,33.5 6.19,33.5
N$42  (via drill 0.3)
  Top 0.152: v21.79,3.28 21.49,3.28 19.28,1.07 9.68,1.07 7.92,2.82 7.92,8.38 LED1.1
  Bottom 0.152: IC14.7 25.07,9.45 24.77,9.45 24.23,9.98 23.77,9.98 23.01,9.22 23.01,6.2 21.92,5.11 21.92,3.4 v21.79,3.28
N$44
  Bottom 0.152: L5.1 29.46,72.73 C15.1 31.39,70.8 33.97,70.8 C14.1 34.13,70.64 34.45,70.33 37.47,70.33 37.47,68.9 37.31,68.74 36.99,68.74 36.04,67.79 IC5.24
N$45  (via drill 0.3)
  Top 0.152: v33.62,68.74 33.62,70.01 35.72,70.01 35.72,46.01 35.13,45.41 35.13,44.2 35.42,43.91 35.42,42.93 35.13,42.64 35.13,41.07 v35.24,40.96
  Bottom 0.152: v33.62,68.74 32.86,68.74 32.86,68.5 32.84,68.5 29.41,68.5 29.03,68.12 29.03,67.82 IC5.13 | v35.24,40.96 35.08,40.8 31.59,40.8 30.64,39.85 27.94,39.85 26.83,38.73 18.1,38.73 16.99,39.85 10.48,39.85 10.32,39.69 R16.2
N$46  (via drill 0.3)
  Top 0.152: v33.34,51.59 v33.34,66.2 | v26.99,39.69 v26.99,51.59
  Bottom 0.152: v26.99,51.59 v33.34,51.59 | v26.99,39.69 23.34,39.69 R17.2 | IC5.14 29.72,67.74 29.72,66.45 30.18,65.99 33.15,65.99 33.3,66.14 v33.34,66.2
N$47  (via drill 0.3)
  Top 0.152: v30.4,66.52 30.4,58.06 31.7,56.77 32.16,56.77 32.77,57.38 32.99,57.61 32.99,63.02 v32.77,63.25 | v37.47,40.8 35.82,42.45 35.82,43.91 36.83,44.92 v36.83,63.18
  Bottom 0.152: v37.47,40.8 36.67,40.01 R15.2 | v30.4,66.52 30.33,66.6 30.33,67.74 IC5.15 | v32.77,63.25 33.45,63.93 35.89,63.93 36.58,63.25 36.8,63.25 v36.83,63.18
N$48  (via drill 0.3)
  Top 0.152: v2.06,66.04 2.06,43.97 2.54,43.5 SLD_A.2
  Bottom 0.152: v2.06,66.04 9.53,66.04 9.53,65.41 IC4.1
N$49
  Bottom 0.152: R17.1 21.59,39.69 23.5,41.59 23.5,43.34 SLD_B.E
N$50
  Bottom 0.152: R16.1 8.57,39.69 10,41.12 10,43.34 SLD_A.E
N$51  (via drill 0.3)
  Top 0.152: v6.55,64.31 6.55,69.95 8.84,72.24 v8.84,73.69
  Bottom 0.152: POT_B.P$2 19.68,76.99 18.57,75.88 18.52,75.89 11.05,75.89 10.97,75.82 v8.84,73.69 | v6.55,64.31 6.93,64.69 6.93,65.23 IC4.5
N$52  (via drill 0.3)
  Top 0.152: v10.29,2.67 12.95,2.67 13.49,2.13 14.78,2.13 16.69,4.04 16.69,5.79 16.69,6.33 21.57,11.2 LED2.2 | v25.43,12.22 26.52,13.31 v26.52,13.59
  Bottom 0.152: LED2.2 21.57,11.28 23.24,11.28 24.22,12.26 25.39,12.26 v25.43,12.22 | v10.29,2.67 9.83,2.67 9.14,1.98 9.14,1.29 8.84,0.99 3.89,0.99 0.76,4.12 0.76,8.08 3.28,10.59 3.28,11.05 R50.1 | v26.52,13.59 26.52,14.74 IC14.10
N$53  (via drill 0.3)
  Top 0.152: v6.83,71.91 6.67,72.07 6.67,76.99 POT_A.P$2
  Bottom 0.152: v6.83,71.91 6.83,70.96 IC4.12
N$54  (via drill 0.3)
  Top 0.152: v7.78,78.42 v7.78,71.91 | v23.55,81.08 23.85,81.08 24.38,80.54 24.38,75.21 v24.23,75.06 | v36.65,77.19 36.65,78.11 35.2,79.55 34.75,79.55 32.77,77.57 32.77,77.19 POT_C.P$2
  Bottom 0.152: IC4.13 7.62,71.91 v7.78,71.91 | v23.55,81.08 23.85,81.08 24.38,80.54 24.38,80.16 24,79.78 19.51,79.78 18.21,78.49 7.85,78.49 v7.78,78.42 | v24.23,75.06 28.8,75.06 29.03,75.29 35.66,75.29 36.65,76.28 v36.65,77.19
N$55  (via drill 0.3)
  Top 0.152: v20.95,66.83 v20.95,69.85 | v34.26,69.37 35.27,69.37 35.4,69.25 35.4,46.35 33.11,44.06 33.11,41.08 30.27,41.08 30.27,42.57 SLD_C.2
  Bottom 0.152: v20.95,69.85 16.99,69.85 16.67,69.53 10.64,69.53 10.48,69.69 8.41,69.69 8.41,70.8 IC4.14 | v20.95,66.83 22.54,66.83 23.83,68.12 23.83,68.25 25.59,70.01 26.92,70.01 27.56,69.37 v34.26,69.37
N$56  (via drill 0.3)
  Top 0.152: v10.79,70.17 10.79,67.79 6.83,63.82 6.83,44.29 6.51,43.97 6.51,42.7 v6.67,42.55
  Bottom 0.152: v10.79,70.17 9.05,70.17 9.05,70.8 IC4.15 | v6.67,42.55 6.67,42.7 6.51,42.86 6.51,44.61 10.95,44.61 12.06,43.5 16.03,43.5 SLD_B.2
N$57  (via drill 0.3)
  Top 0.152: v12.22,45.56 v12.22,80.96
  Bottom 0.152: R26.1 34.61,29.21 38.73,33.34 38.73,46.99 36.35,46.99 R14.2 36.2,47.15 33.81,47.15 | v12.22,45.56 32.23,45.56 33.66,46.99 C30.1 33.81,47.15 | 33.81,47.15 33.81,48.74 34.45,49.37 U2.2 | R2.1 10.82,80.96 v12.22,80.96
N$58  (via drill 0.3)
  Top 0.152: v19.05,29.37 19.53,29.84 v19.53,30.48 | v28.57,30.48 28.57,39.21 27.62,40.16 v27.62,53.18
  Bottom 0.152: v19.05,29.37 16.35,29.37 R25.1 | v28.57,30.48 v19.53,30.48 | v27.62,53.18 27.78,53.34 28.73,53.34 | 28.73,53.34 29.37,53.98 29.37,54.61 U2.9 | 37.47,60.22 31.81,60.22 31.11,59.53 C23.1 30.96,59.53 R7.2 | 28.73,53.34 29.05,53.02 37.31,53.02 37.47,53.18 37.47,60.22 | R3.1 14.76,81.92 24.99,81.92 25.15,82.07 27.51,82.07 27.66,81.92 30.18,81.92 30.48,82.22 36.17,82.22 36.41,81.98 37.93,81.98 38.16,82.22 38.35,82.22 38.79,81.79 38.78,81.78 38.78,79.45 37.99,78.66 37.99,60.33 37.47,60.33 37.47,60.22
N$59  (via drill 0.3)
  Top 0.152: v13.02,29.84 13.34,30.16 13.34,54.29 12.86,54.77 v12.86,80.33 | v32.07,59.53 31.75,59.85 31.75,67.79 29.05,70.48 29.03,70.48 28.73,70.79 28.73,78.79 v28.98,79.05
  Bottom 0.152: U2.13 34.61,54.61 34.61,54.13 35.4,53.34 37.15,53.34 37.15,58.6 C24.1 R8.2 32.18,59.42 v32.07,59.53 | v12.86,80.33 16.51,80.33 16.54,80.39 17.22,81.08 R4.1 17.3,81.15 18.44,81.15 18.48,81.11 18.97,81.61 27.19,81.61 27.46,81.33 27.46,80.56 v28.98,79.05 | R24.1 3.77,29.84 v13.02,29.84
N$60
  Bottom 0.152: IC14.8 25.07,14.78 24.23,14.78 23.24,13.79 21.57,13.79 19.05,11.28 LED2.1
N$61
  Bottom 0.152: IC6.10 12.27,14.86 12.27,14.48 11.43,13.64 R36.2 8.38,13.56 8.38,12.8 5.71,10.13 5.71,7.54 8.15,5.11 8.15,1.83 R45.1
N$62
  Bottom 0.152: 17.78,33.02 18.41,33.66 D4.C 18.41,33.81 18.41,34.92 16.51,36.83 16.51,38.73 Q3.B | R19.2 17.78,33.02 | 17.78,33.02 20,33.02 20.54,32.48 20.54,32.46 R20.2
N$64  (via drill 0.3)
  Top 0.152: v17.14,15.72 17.14,44.13 16.83,44.45 v16.83,48.26
  Bottom 0.152: v17.14,15.72 11.75,15.72 11.75,14.92 IC6.9 | v16.83,48.26 15.56,48.26 R11.1
N$65
  Bottom 0.152: 31.27,33.5 29.84,33.5 R21.2 | 31.27,33.5 32.23,33.5 D5.C 32.38,33.34 33.89,33.34 R22.2 | 31.27,33.5 31.27,38.73 Q4.B
N$66
  Bottom 0.152: 29.49,88.7 29.49,88.77 29.79,88.77 32.61,91.59 IC1.1 | 29.49,88.7 29.49,87.71 C5.1 | 29.49,88.7 26.52,91.67 26.52,92.73 L1.2
N$68
  Bottom 0.152: IC5.23 35.4,67.79 35.4,69.37 36.51,69.37 R5.1
N$84
  Bottom 0.152: IC14.3 27.74,9.37 27.74,8.99 28.12,8.61 31.39,8.61 34.06,11.28 LED3.2 34.14,11.28 34.52,11.66 37.41,11.66 R48.1
N$85
  Bottom 0.152: LED3.1 29.72,9.45 29.03,9.45 IC14.1
N$86  (via drill 0.3)
  Top 0.152: J12.P3 37.41,4.57 37.41,3.81 34.62,1.02 33.96,1.02 31.45,3.53 31.45,10.16 24.38,17.22 24.38,20.27 21.79,22.86 v21.59,23.02
  Bottom 0.152: J12.P3 37.47,6.99 37.49,7.01 37.91,7.42 R43.1 | R32.1 19.82,23.02 v21.59,23.02
N$87  (via drill 0.3)
  Top 0.152: v8.73,46.65 8.73,38.58 10.79,36.51 10.79,25.4 v13.02,23.18
  Bottom 0.152: 21.91,23.81 21.11,24.61 19.93,24.61 R32.2 | 21.91,23.81 22.54,23.18 C33.1 | 21.91,23.81 17.78,23.81 17.14,23.18 R31.1 16.99,23.02 14.29,23.02 R30.1 14.13,23.18 v13.02,23.18 | v8.73,46.65 9.21,46.65 9.21,47.47 9.84,48.1 U3.2
N$93  (via drill 0.3)
  Top 0.152: v6.19,49.85 6.19,42.86 4.6,41.27 v4.6,30.48
  Bottom 0.152: v6.19,49.85 10.48,49.85 10.48,48.9 11.11,48.26 U3.1 | v4.6,30.48 18.73,30.48 22.07,27.15 22.07,24.77 22.54,24.77 C33.2 22.7,24.61 v30.8,24.61 30.86,24.54 34.59,20.8 34.59,16.61 36.73,14.48 37.87,14.48 38.18,14.17 38.18,12.57 38.06,12.46 | 38.06,12.46 38.25,12.27 38.25,9.37 37.67,8.79 36.55,8.79 36.08,8.32 R43.2 | 38.06,12.46 38.02,12.5 31.09,12.5 28.42,9.83 28.42,9.45 IC14.2
N$101  (via drill 0.3)
  Top 0.152: v24.77,62.87 24.92,63.02 24.92,72.71 26.19,73.98 26.21,73.99 27.13,74.91 27.13,81.92 26.14,82.91 26.14,84.51 v24.77,85.88
  Bottom 0.152: v24.77,62.87 25.08,62.55 27.3,62.55 28.73,63.98 30.8,63.98 30.8,62.39 IC5.9 | v24.77,85.88 20.88,85.88 20.04,86.72 20.04,87.55 18.67,88.92 14.02,88.92 13.03,89.92 13.03,90.68 12.8,90.91 12.12,90.91 11.43,91.59 9.96,91.59 7.98,93.57 6.78,93.57 6.25,94.11 6.25,95.71 9.37,98.83 9.37,98.98 A.GREEN_C
N_U
  Bottom 0.152: U2.7 28.26,49.53 29.37,49.53 U2.6
POTS_ADDR_A
  Bottom 0.152: U1.13 15.08,59.69 13.34,59.69 13.34,63.34 10.32,66.36 4.6,66.36 4.6,71.6 4.76,71.75 6.19,71.75 6.19,71.03 IC4.11
POTS_ADDR_B  (via drill 0.3)
  Top 0.152: v17.14,64.61 v17.14,69.22
  Bottom 0.152: v17.14,69.22 10.48,69.22 10.32,69.37 5.71,69.37 5.71,70.8 IC4.10 | v17.14,64.61 17.14,63.5 17.3,63.5 U1.18
POTS_ADDR_C  (via drill 0.3)
  Top 0.152: v13.97,68.1 16.51,65.56 16.51,64.45 16.99,63.98 17.94,63.98 v17.94,64.61
  Bottom 0.152: v13.97,68.1 5.08,68.1 5.08,70.8 IC4.9 | v17.94,64.61 17.94,63.5 18.1,63.5 U1.19
RESET  (via drill 0.3)
  Top 0.152: v26.35,51.12 26.35,52.13 26.78,52.56 26.78,54.97 27.16,55.35 27.16,57.38 26.71,57.82 27.46,58.58 27.46,70.01 26.19,71.28 JP2.4
  Bottom 0.152: U1.4 19.84,54.93 19.84,52.7 21.27,52.7 C28.1 21.43,52.55 22.86,51.12 24.29,51.12 R10.2 24.45,51.12 v26.35,51.12
SW_MODE_A  (via drill 0.3)
  Top 0.152: v20,60.48 20,74.61 18.57,76.04 18.57,79.22 17.3,80.49 17.3,80.54 17.3,87.78 17.3,87.84 15.04,89.94 14.55,90.42 SW_A.3 14.17,90.42 14.17,96.9 SW_A.4
  Bottom 0.152: v20,60.48 20.31,60.18 23.3,60.18 U1.27
SW_MODE_B  (via drill 0.3)
  Top 0.152: SW_B.4 22.02,96.93 22.02,90.45 SW_B.3 21.95,90.37 21.95,83.36 21.87,83.29 21.87,81.46 21.91,81.44 23.5,79.85 23.5,76.04 22.07,74.61 22.07,61.92 21.06,60.92 21.06,59.91 v22.07,58.9
  Bottom 0.152: v22.07,58.9 23.5,58.9 U1.29
SW_MODE_C  (via drill 0.3)
  Top 0.152: v31.93,57.31 31.43,57.81 31.43,67.63 28.42,70.64 28.42,81.12 30.32,83.03 30.32,84.51 29.49,85.34 29.49,90.37 SW_C.3
  Bottom 0.152: v31.93,57.31 31.62,56.99 27.46,56.99 26.67,57.78 23.81,57.78 23.65,57.94 U1.30 | 29.49,96.93 SW_C.4 | 29.49,96.93 SW_C.4 | 29.49,96.93 29.49,90.45 SW_C.3 | 29.49,96.93 SW_C.4
SWCLK
  Bottom 0.152: U1.24 22.23,63.5 23.81,65.09 26.67,65.09 27.46,65.88 27.46,68.74 26.19,68.74 JP2.3
SWDIO
  Bottom 0.152: U1.23 21.43,63.5 21.43,65.09 23.34,65.09 24.45,66.2 26.04,66.2 JP2.2
VCC  (via drill 0.3)
  Top 0.152: v7.59,39.98 7.94,39.64 7.94,17.3 7.81,17.18 7.85,17.14 9.68,15.32 9.68,9.07 9.72,9.02 9.72,5.96 10.64,5.04 10.64,4.11 9.72,3.18 v9.72,1.81 9.75,1.75 10.13,1.37 19.13,1.37 21.64,3.89 21.64,4.85 24.79,8 v27.05,8
  Top 0.254: v5.56,46.67 5.56,66 5.54,66 4.96,66.57 4.99,66.6 | v2.06,40.01 2.06,42.39 1.5,42.96 1.5,66.28 1.82,66.6 4.99,66.6 | 4.99,66.6 5.38,67 5.38,72.14 6.2,72.96 6.2,74.88 5.38,75.7 5.38,78.18 5.41,78.26 5.41,80.92 11.46,86.97 11.46,93.4 v10.9,93.95
  Bottom 0.152: IC6.4 12.86,9.37 12.86,6.99 C35.1 | C35.1 | 12.22,0.95 26.83,0.95 27.15,1.27 U$1.1 | 12.22,0.95 11.91,1.27 11.91,2.01 11.82,2.1 11.82,2.43 10.95,3.3 10.95,5.04 10.95,5.62 10.31,6.26 10.31,7.45 10.41,7.56 10.41,7.57 10.43,7.57 10.44,7.59 11.73,7.59 12.45,6.87 C35.1 | 7.3,46.67 7.3,48.1 U3.4 | v5.56,46.67 7.3,46.67 | 12.22,0.95 10.32,0.95 9.72,1.56 v9.72,1.81 | v7.59,39.98 2.09,39.98 v2.06,40.01 | C31.1 7.3,45.82 7.3,46.67 | 27.13,8 27.13,9.37 IC14.4 | 27.13,8 27.89,7.24 C36.1 | v27.05,8 27.13,8
  Bottom 0.254: C4.1 19.74,93.8 18.75,93.8 17.53,95.02 15.01,95.02 13.87,93.88 C2.1 13.79,93.8 12.8,94.79 11.73,94.79 L3.1 11.66,94.72 v10.9,93.95
VEE  (via drill 0.3)
  Top 0.152: v13.41,18.9 13.49,18.9
  Top 0.254: v13.65,2.7 13.49,2.86 13.49,18.9 13.49,22.82 13.69,23.02 13.69,54.44 13.49,54.64 v13.49,55.4 13.49,57.7 13.25,57.94 13.25,68.5 13.5,68.74 13.49,68.81 v13.49,82.07
  Bottom 0.152: v13.65,2.7 27.94,2.7 29.21,1.43 U$1.2 | 22.78,15.47 22.78,14.71 C37.2 | 22.78,15.47 22.78,15.93 23.09,16.23 26.06,16.23 27.05,15.24 27.05,14.86 IC14.11 | 22.78,15.47 19.58,15.47 16.15,18.9 v13.41,18.9
  Bottom 0.254: v13.49,55.4 10.91,55.4 9.67,56.64 C25.2 7.37,55.79 U3.11 | C10.2 15.32,87.78 15.54,88.01 18.14,88.01 R1.1 18.21,87.94 18.21,87.78 18.97,87.02 18.97,85.72 18.75,85.5 16.46,85.5 16.23,85.72 14.63,85.72 13.49,84.58 v13.49,82.07 | 14.55,87.78 15.16,87.78 C10.2 | C9.2 9.83,87.76 L4.1 12.68,89.88 12.68,89.77 13.87,88.57 14.4,88.57 C10.2

## Text on the board
tPlace: + | + | +
bPlace: MOIRE v1.9-P | 4 | 3 | 2 | 1 | VCC | VEE | 3V3 | 3V3A | -2.5V | GND